# Altium schematic sheet Relay12VDC.SchDoc
size A4; DocumentNumber: 3; SheetNumber: 3; SheetTotal: 4
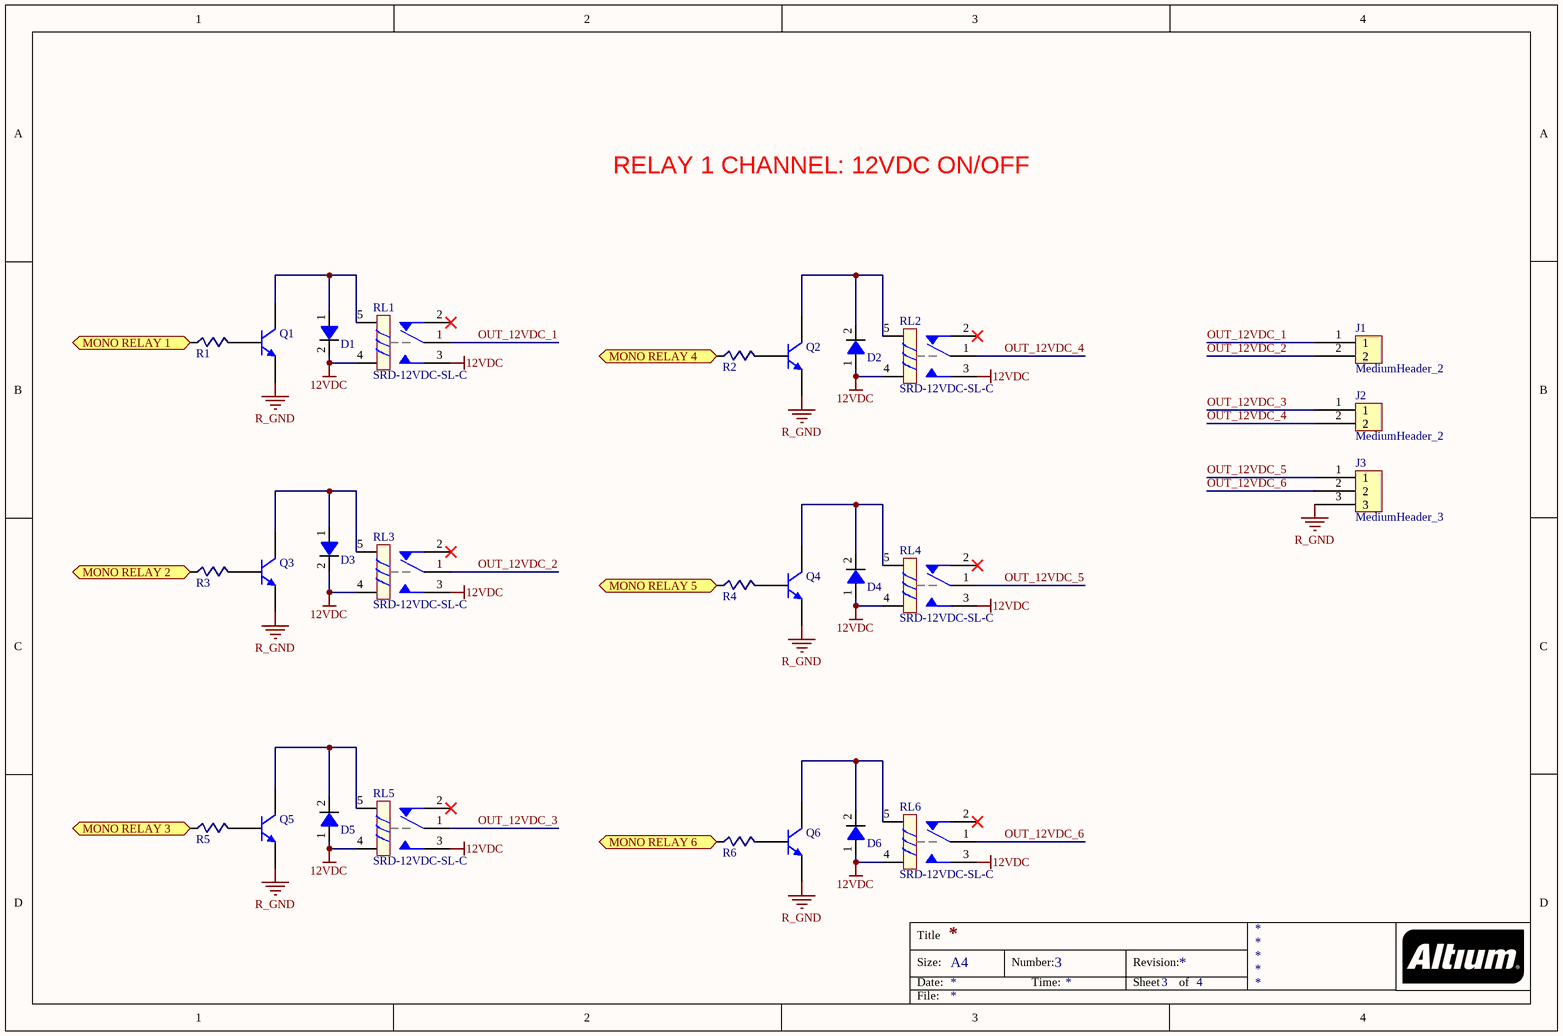
[diagram p0: Relay12VDC.SchDoc]

## Parts
D1  M7 SMD  [Diode 1N4007 SMD]  (value not drawn)
D2  M7 SMD  [Diode 1N4007 SMD]  (value not drawn)
D3  M7 SMD  [Diode 1N4007 SMD]  (value not drawn)
D4  M7 SMD  [Diode 1N4007 SMD]  (value not drawn)
D5  M7 SMD  [Diode 1N4007 SMD]  (value not drawn)
D6  M7 SMD  [Diode 1N4007 SMD]  (value not drawn)
J1  MediumHeader_2  [Medium - Header 2]
J2  MediumHeader_2  [Medium - Header 2]
J3  MediumHeader_3  [Medium - Header 3]
Q1  MMBT3904  [SOT23_L_MOD]  (value not drawn)
Q2  MMBT3904  [SOT23_L_MOD]  (value not drawn)
Q3  MMBT3904  [SOT23_L_MOD]  (value not drawn)
Q4  MMBT3904  [SOT23_L_MOD]  (value not drawn)
Q5  MMBT3904  [SOT23_L_MOD]  (value not drawn)
Q6  MMBT3904  [SOT23_L_MOD]  (value not drawn)
R1  R_1K_0603  [RES-SMD-0603]  (value not drawn)
R2  R_1K_0603  [RES-SMD-0603]  (value not drawn)
R3  R_1K_0603  [RES-SMD-0603]  (value not drawn)
R4  R_1K_0603  [RES-SMD-0603]  (value not drawn)
R5  R_1K_0603  [RES-SMD-0603]  (value not drawn)
R6  R_1K_0603  [RES-SMD-0603]  (value not drawn)
RL1  SRD-12VDC-SL-C  [RELAY SRD-12VDC]
RL2  SRD-12VDC-SL-C  [RELAY SRD-12VDC]
RL3  SRD-12VDC-SL-C  [RELAY SRD-12VDC]
RL4  SRD-12VDC-SL-C  [RELAY SRD-12VDC]
RL5  SRD-12VDC-SL-C  [RELAY SRD-12VDC]
RL6  SRD-12VDC-SL-C  [RELAY SRD-12VDC]

## Ports
MONO RELAY 1, MONO RELAY 2, MONO RELAY 3, MONO RELAY 4, MONO RELAY 5, MONO RELAY 6

## Nets
12VDC: D1.2 D2.1 D3.2 D4.1 D5.1 D6.1 RL1.3 RL1.4 RL2.3 RL2.4 RL3.3 RL3.4 RL4.3 RL4.4 RL5.3 RL5.4 RL6.3 RL6.4
R_GND: J3.3 Q1.2(E) Q2.2(E) Q3.2(E) Q4.2(E) Q5.2(E) Q6.2(E)
MONO RELAY 1: R1.1 ; port MONO RELAY 1
MONO RELAY 2: R3.1 ; port MONO RELAY 2
MONO RELAY 3: R5.1 ; port MONO RELAY 3
MONO RELAY 4: R2.1 ; port MONO RELAY 4
MONO RELAY 5: R4.1 ; port MONO RELAY 5
MONO RELAY 6: R6.1 ; port MONO RELAY 6
OUT_12VDC_1: J1.1 RL1.1
OUT_12VDC_2: J1.2 RL3.1
OUT_12VDC_3: J2.1 RL5.1
OUT_12VDC_4: J2.2 RL2.1
OUT_12VDC_5: J3.1 RL4.1
OUT_12VDC_6: J3.2 RL6.1
NetD1_1: D1.1 Q1.3(C) RL1.5
NetD2_2: D2.2 Q2.3(C) RL2.5
NetD3_1: D3.1 Q3.3(C) RL3.5
NetD4_2: D4.2 Q4.3(C) RL4.5
NetD5_2: D5.2 Q5.3(C) RL5.5
NetD6_2: D6.2 Q6.3(C) RL6.5
NetQ1_1: Q1.1(B) R1.2
NetQ2_1: Q2.1(B) R2.2
NetQ3_1: Q3.1(B) R3.2
NetQ4_1: Q4.1(B) R4.2
NetQ5_1: Q5.1(B) R5.2
NetQ6_1: Q6.1(B) R6.2

Not connected (* = marked no-connect by the designer): RL1 2*; RL2 2*; RL3 2*; RL4 2*; RL5 2*; RL6 2*

## Notes on the sheet
- RELAY 1 CHANNEL: 12VDC ON/OFF
- Title
- Size:
- Date:
- A4
- Number:
- Time:
- Revision:
- Sheet
- of
- File:

## Library data of the parts
D1-D6 = Diode_1N4007: DIODE GEN PURP 1KV 1A DO214AC; Supplier 1: Digi-Key; Supplier Part Number 1: 641-1018-1-ND
Q1-Q6 = MMBT3904: TRANSISTOR GP NPN AMP SOT-23; Published: 17-Sep-2003; LatestRevisionDate: 12-Dec-2006; LatestRevisionNote: IPC-7351 Footprint Added.; DatasheetVersion: 13-May-2002; PackageVersion: May-1999; PackageReference: SOT23; Publisher: Altium Limited; PackageDescription: 3-Pin SOT-23 Package 0.95 mm Pitch, 2.3 mm Lead Span; ComponentLink1Description: Manufacturer Link; ComponentLink1URL: http://www.semiconductors.philips.com/; ComponentLink2Description: Datasheet; ComponentLink2URL: http://www.semiconductors.philips.com/acrobat/datasheets/MMBT3904_4.pdf; Supplier 1: Digi-Key; Supplier Part Number 1: MMBT3904FSDKR-ND
R1-R6 = RES0603_1K: RES 1K OHM 1/10W 1% 0603 SMD; Supplier 1: Digi-Key; Supplier Part Number 1: 311-1.50KHRDKR-ND
RL1-RL6 = RELAY SRD-12VDC: Relay SPDT,10A - 12VDC 5 Pin; Value: Relay SPDT, 10A, 12V